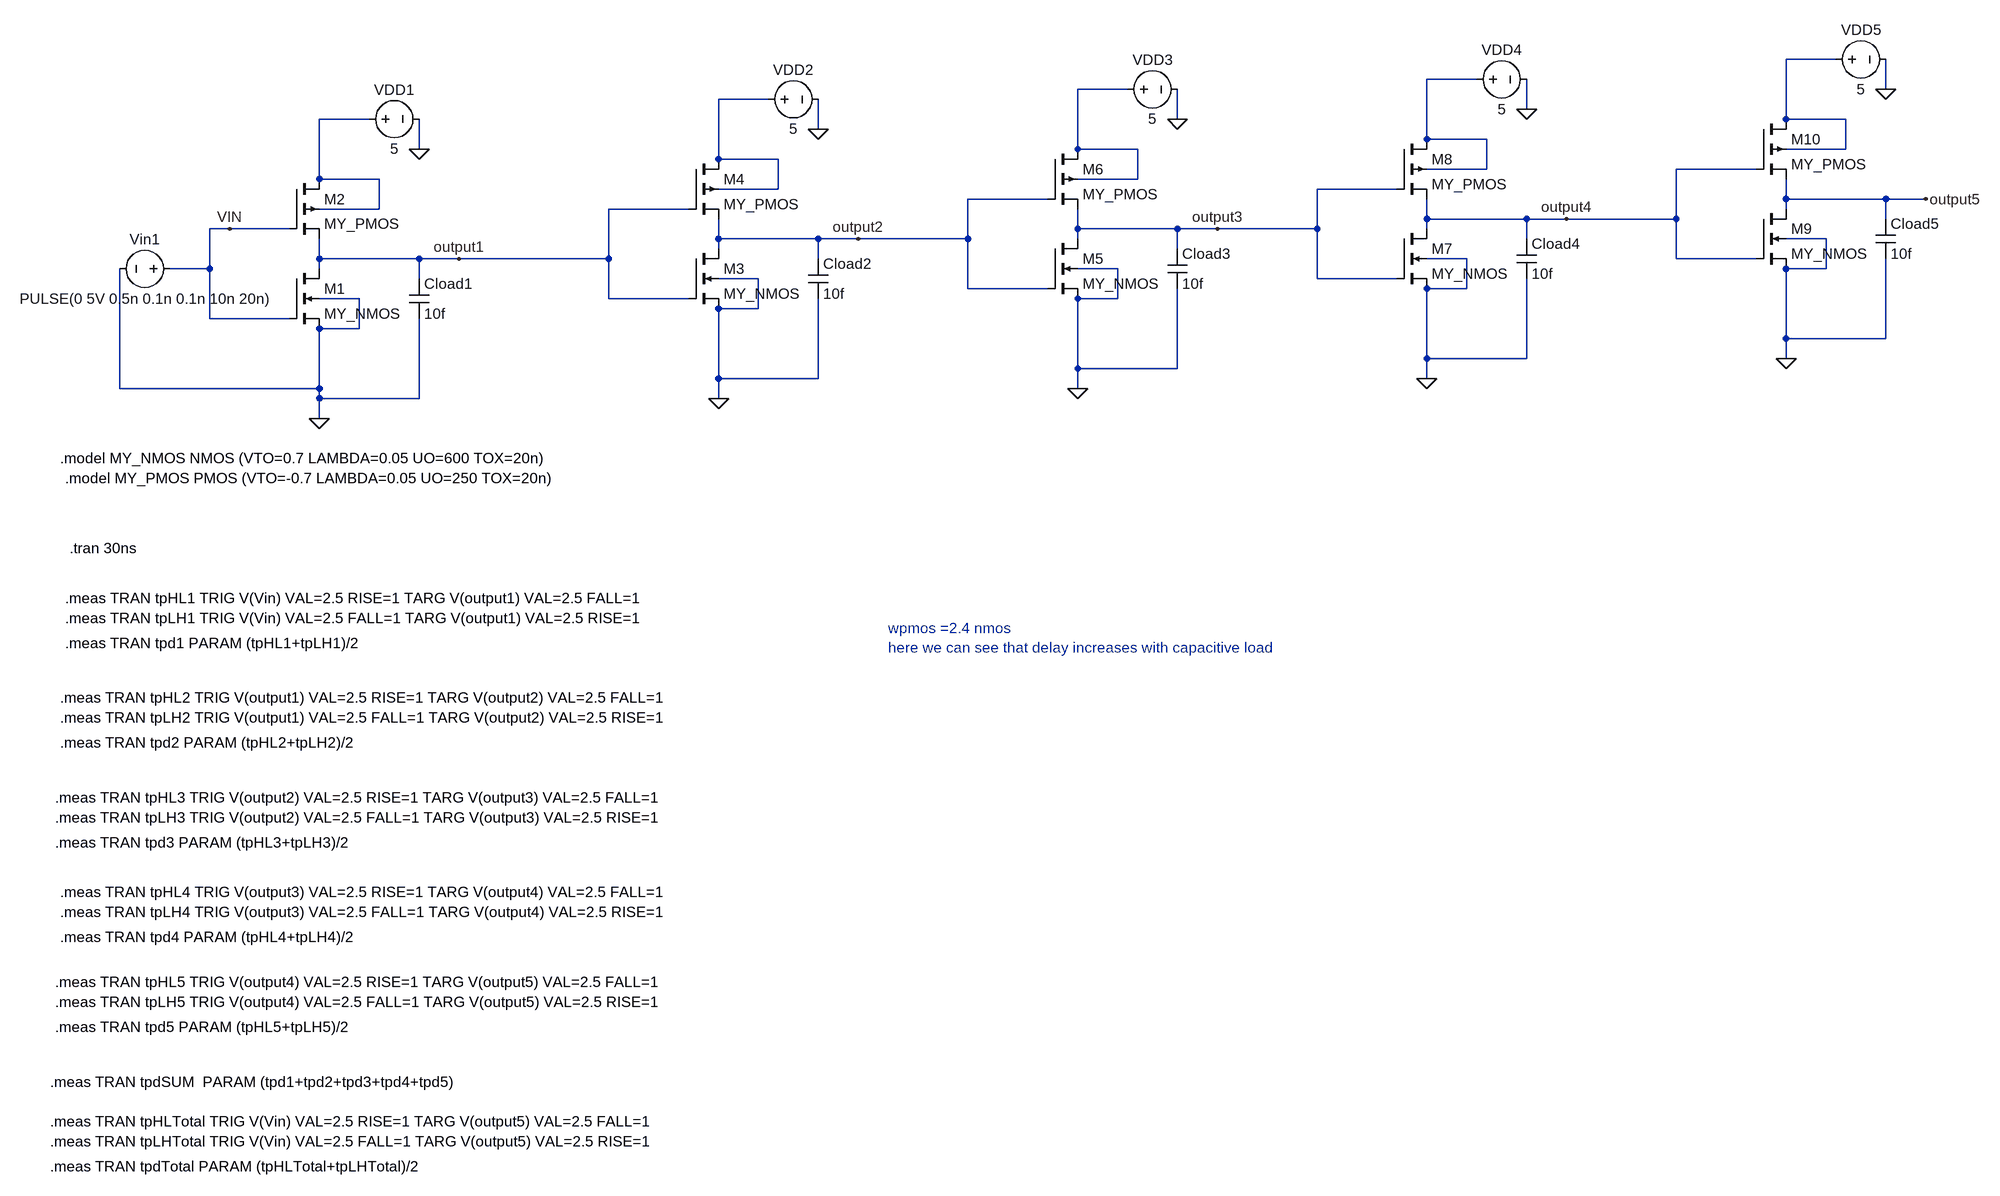
[diagram p0: schematic fanout_effect.asc]
fanout_effect.asc, the LTspice schematic file:
Version 4.1
SHEET 1 1596 1024
WIRE 1344 -768 1264 -768
WIRE 768 -736 688 -736
WIRE 208 -720 128 -720
WIRE 1424 -720 1424 -768
WIRE -368 -704 -448 -704
WIRE 848 -688 848 -736
WIRE -1008 -672 -1088 -672
WIRE 288 -672 288 -720
WIRE 1264 -672 1264 -768
WIRE 1360 -672 1264 -672
WIRE -288 -656 -288 -704
WIRE 688 -640 688 -736
WIRE 784 -640 688 -640
WIRE -928 -624 -928 -672
WIRE 128 -624 128 -720
WIRE 224 -624 128 -624
WIRE 1360 -624 1360 -672
WIRE 1360 -624 1264 -624
WIRE -448 -608 -448 -704
WIRE -352 -608 -448 -608
WIRE 784 -592 784 -640
WIRE 784 -592 688 -592
WIRE 1216 -592 1088 -592
WIRE -1088 -576 -1088 -672
WIRE -992 -576 -1088 -576
WIRE 224 -576 224 -624
WIRE 224 -576 128 -576
WIRE -352 -560 -352 -608
WIRE -352 -560 -448 -560
WIRE 640 -560 512 -560
WIRE 80 -544 -48 -544
WIRE 1264 -544 1264 -576
WIRE 1424 -544 1264 -544
WIRE 1488 -544 1424 -544
WIRE -992 -528 -992 -576
WIRE -992 -528 -1088 -528
WIRE -496 -528 -624 -528
WIRE 1264 -528 1264 -544
WIRE 688 -512 688 -544
WIRE 848 -512 688 -512
WIRE 912 -512 848 -512
WIRE 1088 -512 1088 -592
WIRE 1088 -512 912 -512
WIRE 1424 -512 1424 -544
WIRE -1232 -496 -1264 -496
WIRE -1136 -496 -1232 -496
WIRE 128 -496 128 -528
WIRE 288 -496 128 -496
WIRE 352 -496 288 -496
WIRE 512 -496 512 -560
WIRE 512 -496 352 -496
WIRE 688 -496 688 -512
WIRE -448 -480 -448 -512
WIRE -288 -480 -448 -480
WIRE -224 -480 -288 -480
WIRE -48 -480 -48 -544
WIRE -48 -480 -224 -480
WIRE 128 -480 128 -496
WIRE 848 -480 848 -512
WIRE 1328 -480 1264 -480
WIRE -448 -464 -448 -480
WIRE 288 -464 288 -496
WIRE -1088 -448 -1088 -480
WIRE -928 -448 -1088 -448
WIRE -864 -448 -928 -448
WIRE -624 -448 -624 -528
WIRE -624 -448 -864 -448
WIRE -288 -448 -288 -480
WIRE 752 -448 688 -448
WIRE 1088 -448 1088 -512
WIRE 1216 -448 1088 -448
WIRE -1264 -432 -1264 -496
WIRE -1264 -432 -1328 -432
WIRE -1088 -432 -1088 -448
WIRE 192 -432 128 -432
WIRE 1328 -432 1328 -480
WIRE 1328 -432 1264 -432
WIRE -928 -416 -928 -448
WIRE -384 -416 -448 -416
WIRE 512 -416 512 -496
WIRE 640 -416 512 -416
WIRE -48 -400 -48 -480
WIRE 80 -400 -48 -400
WIRE 752 -400 752 -448
WIRE 752 -400 688 -400
WIRE -1024 -384 -1088 -384
WIRE -624 -384 -624 -448
WIRE -496 -384 -624 -384
WIRE 192 -384 192 -432
WIRE 192 -384 128 -384
WIRE -384 -368 -384 -416
WIRE -384 -368 -448 -368
WIRE -1264 -352 -1264 -432
WIRE -1136 -352 -1264 -352
WIRE -1024 -336 -1024 -384
WIRE -1024 -336 -1088 -336
WIRE 1264 -320 1264 -432
WIRE 1424 -320 1424 -448
WIRE 1424 -320 1264 -320
WIRE 688 -288 688 -400
WIRE 848 -288 848 -416
WIRE 848 -288 688 -288
WIRE 1264 -288 1264 -320
WIRE 128 -272 128 -384
WIRE 288 -272 288 -400
WIRE 288 -272 128 -272
WIRE -448 -256 -448 -368
WIRE -288 -256 -288 -384
WIRE -288 -256 -448 -256
WIRE 688 -256 688 -288
WIRE -1408 -240 -1408 -432
WIRE -1088 -240 -1088 -336
WIRE -1088 -240 -1408 -240
WIRE 128 -240 128 -272
WIRE -1088 -224 -1088 -240
WIRE -928 -224 -928 -352
WIRE -928 -224 -1088 -224
WIRE -448 -224 -448 -256
WIRE -1088 -192 -1088 -224
FLAG -1088 -192 0
FLAG -928 -624 0
FLAG -864 -448 output1
FLAG -448 -224 0
FLAG -288 -656 0
FLAG -224 -480 output2
FLAG 128 -240 0
FLAG 288 -672 0
FLAG 352 -496 output3
FLAG 688 -256 0
FLAG 848 -688 0
FLAG 912 -512 output4
FLAG 1264 -288 0
FLAG 1424 -720 0
FLAG 1488 -544 output5
FLAG -1232 -496 VIN
SYMBOL nmos4 -1136 -432 R0
SYMATTR InstName M1
SYMATTR Value MY_NMOS
SYMATTR Value2 l=1u w=1u
SYMBOL voltage -1312 -432 R90
WINDOW 0 -32 56 VBottom 2
WINDOW 3 32 56 VTop 2
WINDOW 123 0 0 Left 0
WINDOW 39 0 0 Left 0
SYMATTR InstName Vin1
SYMATTR Value PULSE(0 5V 0.5n 0.1n 0.1n 10n 20n)
SYMBOL voltage -1024 -672 R270
WINDOW 0 32 56 VTop 2
WINDOW 3 -32 56 VBottom 2
WINDOW 123 0 0 Left 0
WINDOW 39 0 0 Left 0
SYMATTR InstName VDD1
SYMATTR Value 5
SYMBOL cap -944 -416 R0
SYMATTR InstName Cload1
SYMATTR Value 10f
SYMBOL pmos4 -1136 -576 R0
SYMATTR InstName M2
SYMATTR Value MY_PMOS
SYMATTR Value2 l=1u w=2.4u
SYMBOL nmos4 -496 -464 R0
SYMATTR InstName M3
SYMATTR Value MY_NMOS
SYMATTR Value2 l=1u w=1u
SYMBOL voltage -384 -704 R270
WINDOW 0 32 56 VTop 2
WINDOW 3 -32 56 VBottom 2
WINDOW 123 0 0 Left 0
WINDOW 39 0 0 Left 0
SYMATTR InstName VDD2
SYMATTR Value 5
SYMBOL cap -304 -448 R0
SYMATTR InstName Cload2
SYMATTR Value 10f
SYMBOL pmos4 -496 -608 R0
SYMATTR InstName M4
SYMATTR Value MY_PMOS
SYMATTR Value2 l=1u w=2.4u
SYMBOL nmos4 80 -480 R0
SYMATTR InstName M5
SYMATTR Value MY_NMOS
SYMATTR Value2 l=1u w=1u
SYMBOL voltage 192 -720 R270
WINDOW 0 32 56 VTop 2
WINDOW 3 -32 56 VBottom 2
WINDOW 123 0 0 Left 0
WINDOW 39 0 0 Left 0
SYMATTR InstName VDD3
SYMATTR Value 5
SYMBOL cap 272 -464 R0
SYMATTR InstName Cload3
SYMATTR Value 10f
SYMBOL pmos4 80 -624 R0
SYMATTR InstName M6
SYMATTR Value MY_PMOS
SYMATTR Value2 l=1u w=2.4u
SYMBOL nmos4 640 -496 R0
SYMATTR InstName M7
SYMATTR Value MY_NMOS
SYMATTR Value2 l=1u w=1u
SYMBOL voltage 752 -736 R270
WINDOW 0 32 56 VTop 2
WINDOW 3 -32 56 VBottom 2
WINDOW 123 0 0 Left 0
WINDOW 39 0 0 Left 0
SYMATTR InstName VDD4
SYMATTR Value 5
SYMBOL cap 832 -480 R0
SYMATTR InstName Cload4
SYMATTR Value 10f
SYMBOL pmos4 640 -640 R0
SYMATTR InstName M8
SYMATTR Value MY_PMOS
SYMATTR Value2 l=1u w=2.4u
SYMBOL nmos4 1216 -528 R0
SYMATTR InstName M9
SYMATTR Value MY_NMOS
SYMATTR Value2 l=1u w=1u
SYMBOL voltage 1328 -768 R270
WINDOW 0 32 56 VTop 2
WINDOW 3 -32 56 VBottom 2
WINDOW 123 0 0 Left 0
WINDOW 39 0 0 Left 0
SYMATTR InstName VDD5
SYMATTR Value 5
SYMBOL cap 1408 -512 R0
SYMATTR InstName Cload5
SYMATTR Value 10f
SYMBOL pmos4 1216 -672 R0
SYMATTR InstName M10
SYMATTR Value MY_PMOS
SYMATTR Value2 l=1u w=2.4u
TEXT -1504 -128 Left 2 !.model MY_NMOS NMOS (VTO=0.7 LAMBDA=0.05 UO=600 TOX=20n)
TEXT -1496 -96 Left 2 !.model MY_PMOS PMOS (VTO=-0.7 LAMBDA=0.05 UO=250 TOX=20n)
TEXT -1488 16 Left 2 !.tran 30ns
TEXT -1496 96 Left 2 !.meas TRAN tpHL1 TRIG V(Vin) VAL=2.5 RISE=1 TARG V(output1) VAL=2.5 FALL=1
TEXT -1496 128 Left 2 !.meas TRAN tpLH1 TRIG V(Vin) VAL=2.5 FALL=1 TARG V(output1) VAL=2.5 RISE=1
TEXT -1496 168 Left 2 !.meas TRAN tpd1 PARAM (tpHL1+tpLH1)/2
TEXT -176 144 Left 2 ;wpmos =2.4 nmos\nhere we can see that delay increases with capacitive load
TEXT -1504 256 Left 2 !.meas TRAN tpHL2 TRIG V(output1) VAL=2.5 RISE=1 TARG V(output2) VAL=2.5 FALL=1
TEXT -1504 288 Left 2 !.meas TRAN tpLH2 TRIG V(output1) VAL=2.5 FALL=1 TARG V(output2) VAL=2.5 RISE=1
TEXT -1504 328 Left 2 !.meas TRAN tpd2 PARAM (tpHL2+tpLH2)/2
TEXT -1512 416 Left 2 !.meas TRAN tpHL3 TRIG V(output2) VAL=2.5 RISE=1 TARG V(output3) VAL=2.5 FALL=1
TEXT -1512 448 Left 2 !.meas TRAN tpLH3 TRIG V(output2) VAL=2.5 FALL=1 TARG V(output3) VAL=2.5 RISE=1
TEXT -1512 488 Left 2 !.meas TRAN tpd3 PARAM (tpHL3+tpLH3)/2
TEXT -1504 568 Left 2 !.meas TRAN tpHL4 TRIG V(output3) VAL=2.5 RISE=1 TARG V(output4) VAL=2.5 FALL=1
TEXT -1504 600 Left 2 !.meas TRAN tpLH4 TRIG V(output3) VAL=2.5 FALL=1 TARG V(output4) VAL=2.5 RISE=1
TEXT -1504 640 Left 2 !.meas TRAN tpd4 PARAM (tpHL4+tpLH4)/2
TEXT -1512 712 Left 2 !.meas TRAN tpHL5 TRIG V(output4) VAL=2.5 RISE=1 TARG V(output5) VAL=2.5 FALL=1
TEXT -1512 744 Left 2 !.meas TRAN tpLH5 TRIG V(output4) VAL=2.5 FALL=1 TARG V(output5) VAL=2.5 RISE=1
TEXT -1512 784 Left 2 !.meas TRAN tpd5 PARAM (tpHL5+tpLH5)/2
TEXT -1520 872 Left 2 !.meas TRAN tpdSUM  PARAM (tpd1+tpd2+tpd3+tpd4+tpd5)
TEXT -1520 936 Left 2 !.meas TRAN tpHLTotal TRIG V(Vin) VAL=2.5 RISE=1 TARG V(output5) VAL=2.5 FALL=1
TEXT -1520 968 Left 2 !.meas TRAN tpLHTotal TRIG V(Vin) VAL=2.5 FALL=1 TARG V(output5) VAL=2.5 RISE=1
TEXT -1520 1008 Left 2 !.meas TRAN tpdTotal PARAM (tpHLTotal+tpLHTotal)/2

The netlist it stands for:
* fanout_effect.asc
M1 output1 VIN 0 0 MY_NMOS l=1u w=1u
Vin1 VIN 0 PULSE(0 5V 0.5n 0.1n 0.1n 10n 20n)
VDD1 N005 0 5
Cload1 output1 0 10f
M2 N005 VIN output1 N005 MY_PMOS l=1u w=2.4u
M3 output2 output1 0 0 MY_NMOS l=1u w=1u
VDD2 N004 0 5
Cload2 output2 0 10f
M4 N004 output1 output2 N004 MY_PMOS l=1u w=2.4u
M5 output3 output2 0 0 MY_NMOS l=1u w=1u
VDD3 N003 0 5
Cload3 output3 0 10f
M6 N003 output2 output3 N003 MY_PMOS l=1u w=2.4u
M7 output4 output3 0 0 MY_NMOS l=1u w=1u
VDD4 N002 0 5
Cload4 output4 0 10f
M8 N002 output3 output4 N002 MY_PMOS l=1u w=2.4u
M9 output5 output4 0 0 MY_NMOS l=1u w=1u
VDD5 N001 0 5
Cload5 output5 0 10f
M10 N001 output4 output5 N001 MY_PMOS l=1u w=2.4u
.model NMOS NMOS
.model PMOS PMOS
.lib standard.mos
.model MY_NMOS NMOS (VTO=0.7 LAMBDA=0.05 UO=600 TOX=20n)
.model MY_PMOS PMOS (VTO=-0.7 LAMBDA=0.05 UO=250 TOX=20n)
.tran 30ns
.meas TRAN tpHL1 TRIG V(Vin) VAL=2.5 RISE=1 TARG V(output1) VAL=2.5 FALL=1
.meas TRAN tpLH1 TRIG V(Vin) VAL=2.5 FALL=1 TARG V(output1) VAL=2.5 RISE=1
.meas TRAN tpd1 PARAM (tpHL1+tpLH1)/2
* wpmos =2.4 nmos
* here we can see that delay increases with capacitive load
.meas TRAN tpHL2 TRIG V(output1) VAL=2.5 RISE=1 TARG V(output2) VAL=2.5 FALL=1
.meas TRAN tpLH2 TRIG V(output1) VAL=2.5 FALL=1 TARG V(output2) VAL=2.5 RISE=1
.meas TRAN tpd2 PARAM (tpHL2+tpLH2)/2
.meas TRAN tpHL3 TRIG V(output2) VAL=2.5 RISE=1 TARG V(output3) VAL=2.5 FALL=1
.meas TRAN tpLH3 TRIG V(output2) VAL=2.5 FALL=1 TARG V(output3) VAL=2.5 RISE=1
.meas TRAN tpd3 PARAM (tpHL3+tpLH3)/2
.meas TRAN tpHL4 TRIG V(output3) VAL=2.5 RISE=1 TARG V(output4) VAL=2.5 FALL=1
.meas TRAN tpLH4 TRIG V(output3) VAL=2.5 FALL=1 TARG V(output4) VAL=2.5 RISE=1
.meas TRAN tpd4 PARAM (tpHL4+tpLH4)/2
.meas TRAN tpHL5 TRIG V(output4) VAL=2.5 RISE=1 TARG V(output5) VAL=2.5 FALL=1
.meas TRAN tpLH5 TRIG V(output4) VAL=2.5 FALL=1 TARG V(output5) VAL=2.5 RISE=1
.meas TRAN tpd5 PARAM (tpHL5+tpLH5)/2
.meas TRAN tpdSUM  PARAM (tpd1+tpd2+tpd3+tpd4+tpd5)
.meas TRAN tpHLTotal TRIG V(Vin) VAL=2.5 RISE=1 TARG V(output5) VAL=2.5 FALL=1
.meas TRAN tpLHTotal TRIG V(Vin) VAL=2.5 FALL=1 TARG V(output5) VAL=2.5 RISE=1
.meas TRAN tpdTotal PARAM (tpHLTotal+tpLHTotal)/2
.backanno
.end